# EAGLE design arduino_minimal (EAGLE 7.2.0)
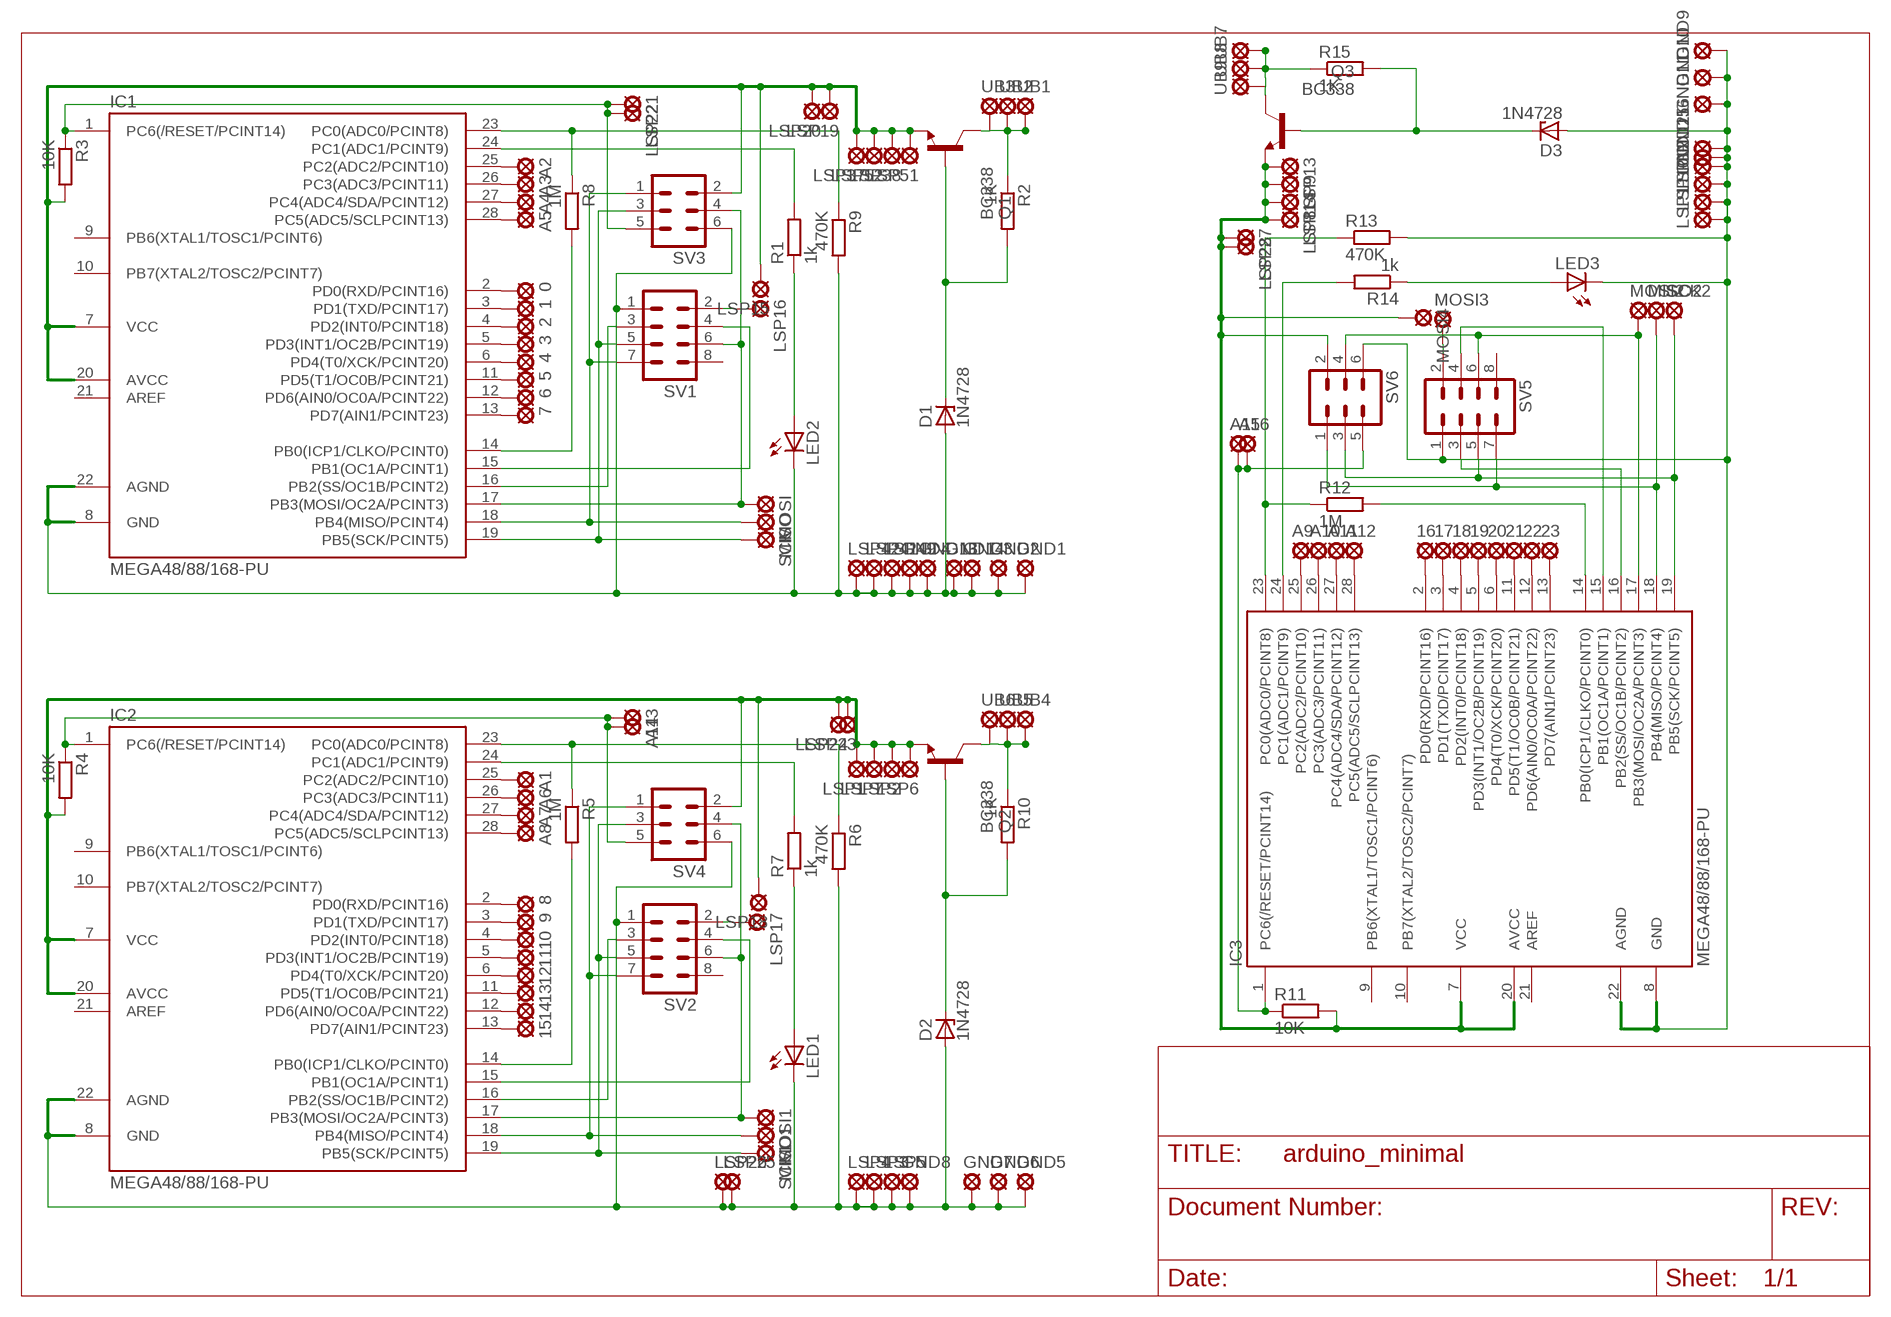
[diagram p0: schematic, sheet 1]

## Parts
0  LSP10  [LSP10]
1  LSP10  [LSP10]
2  LSP10  [LSP10]
3  LSP10  [LSP10]
4  LSP10  [LSP10]
5  LSP10  [LSP10]
6  LSP10  [LSP10]
7  LSP10  [LSP10]
8  LSP10  [LSP10]
9  LSP10  [LSP10]
10  LSP10  [LSP10]
11  LSP10  [LSP10]
12  LSP10  [LSP10]
13  LSP10  [LSP10]
14  LSP10  [LSP10]
15  LSP10  [LSP10]
16  LSP10  [LSP10]
17  LSP10  [LSP10]
18  LSP10  [LSP10]
19  LSP10  [LSP10]
20  LSP10  [LSP10]
21  LSP10  [LSP10]
22  LSP10  [LSP10]
23  LSP10  [LSP10]
A1  LSP10  [LSP10]
A2  LSP10  [LSP10]
A3  LSP10  [LSP10]
A4  LSP10  [LSP10]
A5  LSP10  [LSP10]
A6  LSP10  [LSP10]
A7  LSP10  [LSP10]
A8  LSP10  [LSP10]
A9  LSP10  [LSP10]
A10  LSP10  [LSP10]
A11  LSP10  [LSP10]
A12  LSP10  [LSP10]
A13  LSP10  [LSP10]
A14  LSP10  [LSP10]
A15  LSP10  [LSP10]
A16  LSP10  [LSP10]
D1  1N4728  [DO41Z10]
D2  1N4728  [DO41Z10]
D3  1N4728  [DO41Z10]
GND1  LSP10  [LSP10]
GND2  LSP10  [LSP10]
GND3  LSP10  [LSP10]
GND4  LSP10  [LSP10]
GND5  LSP10  [LSP10]
GND6  LSP10  [LSP10]
GND7  LSP10  [LSP10]
GND8  LSP10  [LSP10]
GND9  LSP10  [LSP10]
GND10  LSP10  [LSP10]
GND11  LSP10  [LSP10]
GND12  LSP10  [LSP10]
GND13  LSP10  [LSP10]
GND14  LSP10  [LSP10]
GND15  LSP10  [LSP10]
GND16  LSP10  [LSP10]
IC1  MEGA48/88/168-PU  [DIL28-3]
IC2  MEGA48/88/168-PU  [DIL28-3]
IC3  MEGA48/88/168-PU  [DIL28-3]
LED1  LED3MM  [LED3MM]
LED2  LED3MM  [LED3MM]
LED3  LED3MM  [LED3MM]
LSP1  LSP10  [LSP10]
LSP2  LSP10  [LSP10]
LSP3  LSP10  [LSP10]
LSP4  LSP10  [LSP10]
LSP5  LSP10  [LSP10]
LSP6  LSP10  [LSP10]
LSP7  LSP10  [LSP10]
LSP8  LSP10  [LSP10]
LSP9  LSP10  [LSP10]
LSP10  LSP10  [LSP10]
LSP11  LSP10  [LSP10]
LSP12  LSP10  [LSP10]
LSP13  LSP10  [LSP10]
LSP14  LSP10  [LSP10]
LSP15  LSP10  [LSP10]
LSP16  LSP10  [LSP10]
LSP17  LSP10  [LSP10]
LSP18  LSP10  [LSP10]
LSP19  LSP10  [LSP10]
LSP20  LSP10  [LSP10]
LSP21  LSP10  [LSP10]
LSP22  LSP10  [LSP10]
LSP23  LSP10  [LSP10]
LSP24  LSP10  [LSP10]
LSP25  LSP10  [LSP10]
LSP26  LSP10  [LSP10]
LSP27  LSP10  [LSP10]
LSP28  LSP10  [LSP10]
LSP37  LSP10  [LSP10]
LSP38  LSP10  [LSP10]
LSP41  LSP10  [LSP10]
LSP42  LSP10  [LSP10]
LSP49  LSP10  [LSP10]
LSP51  LSP10  [LSP10]
LSP52  LSP10  [LSP10]
MISO  LSP10  [LSP10]
MISO1  LSP10  [LSP10]
MISO2  LSP10  [LSP10]
MOSI  LSP10  [LSP10]
MOSI1  LSP10  [LSP10]
MOSI2  LSP10  [LSP10]
MOSI3  LSP10  [LSP10]
MOSI4  LSP10  [LSP10]
Q1  BC338  [TO92-EBC]
Q2  BC338  [TO92-EBC]
Q3  BC338  [TO92-EBC]
R1  1k  R-EU_0204/7  [0204/7]
R2  1K  R-EU_0204/7  [0204/7]
R3  10K  R-EU_0204/7  [0204/7]
R4  10K  R-EU_0204/7  [0204/7]
R5  1M  R-EU_0204/7  [0204/7]
R6  470K  R-EU_0204/7  [0204/7]
R7  1k  R-EU_0204/7  [0204/7]
R8  1M  R-EU_0204/7  [0204/7]
R9  470K  R-EU_0204/7  [0204/7]
R10  1K  R-EU_0204/7  [0204/7]
R11  10K  R-EU_0204/7  [0204/7]
R12  1M  R-EU_0204/7  [0204/7]
R13  470K  R-EU_0204/7  [0204/7]
R14  1k  R-EU_0204/7  [0204/7]
R15  1K  R-EU_0204/7  [0204/7]
SCK  LSP10  [LSP10]
SCK1  LSP10  [LSP10]
SCK2  LSP10  [LSP10]
SV1  MA04-2  [MA04-2]
SV2  MA04-2  [MA04-2]
SV3  MA03-2  [MA03-2]
SV4  MA03-2  [MA03-2]
SV5  MA04-2  [MA04-2]
SV6  MA03-2  [MA03-2]
UB1  LSP10  [LSP10]
UB2  LSP10  [LSP10]
UB3  LSP10  [LSP10]
UB4  LSP10  [LSP10]
UB5  LSP10  [LSP10]
UB6  LSP10  [LSP10]
UB7  LSP10  [LSP10]
UB8  LSP10  [LSP10]
UB9  LSP10  [LSP10]

## Nets
CE1: IC1.16(PB2(SS/OC1B/PCINT2)) SV1.3
CSN1: IC1.15(PB1(OC1A/PCINT1)) SV1.4
GND: D1.A GND1.MP GND2.MP GND3.MP GND4.MP GND13.MP GND14.MP IC1.8(GND) IC1.22(AGND) LED2.K(C) LSP41.MP LSP42.MP LSP49.MP R9.2 SV1.1 SV3.6
MISO1: IC1.18(PB4(MISO/PCINT4)) MISO.MP SV1.7 SV3.1
MOSI1: IC1.17(PB3(MOSI/OC2A/PCINT3)) MOSI.MP SV1.6 SV3.4
N$1: A13.MP A14.MP IC2.1(PC6(/RESET/PCINT14)) R4.1 SV4.5
N$2: LSP16.MP SV1.2
N$3: IC1.14(PB0(ICP1/CLKO/PCINT0)) R8.2
N$4: IC2.14(PB0(ICP1/CLKO/PCINT0)) R5.2
N$5: IC1.23(PC0(ADC0/PCINT8)) R8.1 R9.1
N$6: IC2.23(PC0(ADC0/PCINT8)) R5.1 R6.1
N$7: IC2.24(PC1(ADC1/PCINT9)) R7.2
N$8: LED1.A R7.1
N$9: IC1.24(PC1(ADC1/PCINT9)) R1.2
N$10: LED2.A R1.1
N$11: IC2.15(PB1(OC1A/PCINT1)) SV2.4
N$12: IC2.16(PB2(SS/OC1B/PCINT2)) SV2.3
N$13: IC2.17(PB3(MOSI/OC2A/PCINT3)) MOSI1.MP SV2.6 SV4.4
N$14: IC2.18(PB4(MISO/PCINT4)) MISO1.MP SV2.7 SV4.1
N$15: IC2.19(PB5(SCK/PCINT5)) SCK1.MP SV2.5 SV4.3
N$18: LSP17.MP SV2.2
N$19: MOSI3.MP SV5.2
N$21: 15.MP IC2.13(PD7(AIN1/PCINT23))
N$22: 14.MP IC2.12(PD6(AIN0/OC0A/PCINT22))
N$23: 13.MP IC2.11(PD5(T1/OC0B/PCINT21))
N$24: 12.MP IC2.6(PD4(T0/XCK/PCINT20))
N$25: 11.MP IC2.5(PD3(INT1/OC2B/PCINT19))
N$26: 10.MP IC2.4(PD2(INT0/PCINT18))
N$27: 9.MP IC2.3(PD1(TXD/PCINT17))
N$28: 8.MP IC2.2(PD0(RXD/PCINT16))
N$29: A1.MP IC2.25(PC2(ADC2/PCINT10))
N$30: A6.MP IC2.26(PC3(ADC3/PCINT11))
N$31: A7.MP IC2.27(PC4(ADC4/SDA/PCINT12))
N$32: A8.MP IC2.28(PC5(ADC5/SCLPCINT13))
N$33: 7.MP IC1.13(PD7(AIN1/PCINT23))
N$34: 6.MP IC1.12(PD6(AIN0/OC0A/PCINT22))
N$35: 5.MP IC1.11(PD5(T1/OC0B/PCINT21))
N$36: 4.MP IC1.6(PD4(T0/XCK/PCINT20))
N$37: 3.MP IC1.5(PD3(INT1/OC2B/PCINT19))
N$38: 2.MP IC1.4(PD2(INT0/PCINT18))
N$39: 1.MP IC1.3(PD1(TXD/PCINT17))
N$40: 0.MP IC1.2(PD0(RXD/PCINT16))
N$41: A2.MP IC1.25(PC2(ADC2/PCINT10))
N$42: A3.MP IC1.26(PC3(ADC3/PCINT11))
N$43: A4.MP IC1.27(PC4(ADC4/SDA/PCINT12))
N$44: A5.MP IC1.28(PC5(ADC5/SCLPCINT13))
N$46: D2.A GND5.MP GND6.MP GND7.MP GND8.MP IC2.8(GND) IC2.22(AGND) LED1.K(C) LSP3.MP LSP4.MP LSP5.MP LSP25.MP LSP26.MP R6.2 SV2.1 SV4.6
N$47: Q1.C R2.1 UB1.MP UB2.MP UB3.MP
N$48: D1.C Q1.B R2.2
N$49: Q2.C R10.1 UB4.MP UB5.MP UB6.MP
N$50: D2.C Q2.B R10.2
N$51: A15.MP A16.MP IC3.1(PC6(/RESET/PCINT14)) R11.1 SV6.5
N$52: IC3.14(PB0(ICP1/CLKO/PCINT0)) R12.2
N$53: IC3.23(PC0(ADC0/PCINT8)) R12.1 R13.1
N$54: IC3.24(PC1(ADC1/PCINT9)) R14.2
N$55: LED3.A R14.1
N$56: IC3.15(PB1(OC1A/PCINT1)) SV5.4
N$57: IC3.16(PB2(SS/OC1B/PCINT2)) SV5.3
N$58: IC3.17(PB3(MOSI/OC2A/PCINT3)) MOSI2.MP SV5.6 SV6.4
N$59: IC3.18(PB4(MISO/PCINT4)) MISO2.MP SV5.7 SV6.1
N$60: IC3.19(PB5(SCK/PCINT5)) SCK2.MP SV5.5 SV6.3
N$61: 23.MP IC3.13(PD7(AIN1/PCINT23))
N$62: 22.MP IC3.12(PD6(AIN0/OC0A/PCINT22))
N$63: 21.MP IC3.11(PD5(T1/OC0B/PCINT21))
N$64: 20.MP IC3.6(PD4(T0/XCK/PCINT20))
N$65: 19.MP IC3.5(PD3(INT1/OC2B/PCINT19))
N$66: 18.MP IC3.4(PD2(INT0/PCINT18))
N$67: 17.MP IC3.3(PD1(TXD/PCINT17))
N$68: 16.MP IC3.2(PD0(RXD/PCINT16))
N$69: A9.MP IC3.25(PC2(ADC2/PCINT10))
N$70: A10.MP IC3.26(PC3(ADC3/PCINT11))
N$71: A11.MP IC3.27(PC4(ADC4/SDA/PCINT12))
N$72: A12.MP IC3.28(PC5(ADC5/SCLPCINT13))
N$73: D3.A GND9.MP GND10.MP GND11.MP GND12.MP GND15.MP GND16.MP IC3.8(GND) IC3.22(AGND) LED3.K(C) LSP10.MP LSP11.MP LSP12.MP R13.2 SV5.1 SV6.6
N$74: Q3.C R15.1 UB7.MP UB8.MP UB9.MP
N$75: D3.C Q3.B R15.2
RES: IC1.1(PC6(/RESET/PCINT14)) LSP21.MP LSP22.MP R3.1 SV3.5
SCK1: IC1.19(PB5(SCK/PCINT5)) SCK.MP SV1.5 SV3.3
VCC: IC1.7(VCC) IC1.20(AVCC) LSP15.MP LSP19.MP LSP20.MP LSP37.MP LSP38.MP LSP51.MP LSP52.MP Q1.E R3.2 SV3.2
VCC1: IC2.7(VCC) IC2.20(AVCC) LSP1.MP LSP2.MP LSP6.MP LSP7.MP LSP18.MP LSP23.MP LSP24.MP Q2.E R4.2 SV4.2
VCC2: IC3.7(VCC) IC3.20(AVCC) LSP8.MP LSP9.MP LSP13.MP LSP14.MP LSP27.MP LSP28.MP MOSI4.MP Q3.E R11.2 SV6.2
Unconnected: IC1.9(PB6(XTAL1/TOSC1/PCINT6)) IC1.10(PB7(XTAL2/TOSC2/PCINT7)) IC1.21(AREF) IC2.9(PB6(XTAL1/TOSC1/PCINT6)) IC2.10(PB7(XTAL2/TOSC2/PCINT7)) IC2.21(AREF) IC3.9(PB6(XTAL1/TOSC1/PCINT6)) IC3.10(PB7(XTAL2/TOSC2/PCINT7)) IC3.21(AREF) SV1.8 SV2.8 SV5.8

## Library data of the parts
0 1-23 A1-A16 GND1-GND16 LSP1-LSP28 LSP37 LSP38 LSP41 LSP42 LSP49 LSP51 LSP52 MISO MISO1 MISO2 MOSI MOSI1-MOSI4 SCK SCK1 SCK2 UB1-UB9 = solpad:LSP10: SOLDER PAD drill 1.0 mm, distributor Buerklin, 12H555
D1-D3 = diode:1N4728: Z DIODE 3.3 V, 1W, 5 percent
IC1-IC3 = avr-7:MEGA48/88/168-PU
LED1-LED3 = led:LED: LED OSRAM: - CHIPLED LG R971, LG N971, LY N971, LG Q971, LY Q971, LO R971, LY R971 LH N974, LH R974 LS Q976, LO Q976, LY Q976 LO Q996 - Hyper CHIPLED LW Q18S LB Q993, LB Q99A, LB R99A - SideLED LS A670, LO A670, LY A670, LG A670, LP A670 LB A673, LV A673, LT A673, LW A673 LH A674 LY A675 LS A676, LA A676, LO A676, LY A676, LW A676 LS A679, LY A679, LG A679 - Hyper Micro SIDELED® LS Y876, LA Y876, LO Y876, LY Y876 LT Y87S - SmartLED LW L88C, LW L88S LB L89C, LB L89S, LG L890 LS L89K, LO L89K, LY L89K LS L896, LA L896, LO L896, LY L896 - TOPLED LS T670, LO T670, LY T670, LG T670, LP T670 LSG T670, LSP T670, LSY T670, LOP T670, LYG T670 LG T671, LOG T671, LSG T671 LB T673, LV T673, LT T673, LW T673 LH T674 LS T676, LA T676, LO T676, LY T676, LB T676, LH T676, LSB T676, LW T676 LB T67C, LV T67C, LT T67C, LS T67K, LO T67K, LY T67K, LW E67C LS E67B, LA E67B, LO E67B, LY E67B, LB E67C, LV E67C, LT E67C LW T67C LS T679, LY T679, LG T679 LS T770, LO T770, LY T770, LG T770, LP T770 LB T773, LV T773, LT T773, LW T773 LH T774 LS E675, LA E675, LY E675, LS T675 LS T776, LA T776, LO T776, LY T776, LB T776 LHGB T686 LT T68C, LB T68C - Hyper Mini TOPLED® LB M676 - Mini TOPLED Santana® LG M470 LS M47K, LO M47K, LY M47K Source: http://www.osram.convergy.de LUXEON: - LUMILED® LXK2-PW12-R00, LXK2-PW12-S00, LXK2-PW14-U00, LXK2-PW14-V00 LXK2-PM12-R00, LXK2-PM12-S00, LXK2-PM14-U00 LXK2-PE12-Q00, LXK2-PE12-R00, LXK2-PE12-S00, LXK2-PE14-T00, LXK2-PE14-U00 LXK2-PB12-K00, LXK2-PB12-L00, LXK2-PB12-M00, LXK2-PB14-N00, LXK2-PB14-P00, LXK2-PB14-Q00 LXK2-PR12-L00, LXK2-PR12-M00, LXK2-PR14-Q00, LXK2-PR14-R00 LXK2-PD12-Q00, LXK2-PD12-R00, LXK2-PD12-S00 LXK2-PH12-R00, LXK2-PH12-S00 LXK2-PL12-P00, LXK2-PL12-Q00, LXK2-PL12-R00 Source: www.luxeon.com KINGBRIGHT: KA-3528ASYC Source: www.kingbright.com
Q1-Q3 = transistor-npn:BC338*: NPN Transistor
R1-R15 = resistor:R-EU_: RESISTOR, European symbol
SV1 SV2 SV5 = con-lstb:MA04-2: PIN HEADER; OC_FARNELL: unknown; OC_NEWARK: unknown
SV3 SV4 SV6 = con-lstb:MA03-2: PIN HEADER; OC_FARNELL: unknown; OC_NEWARK: unknown

## Board
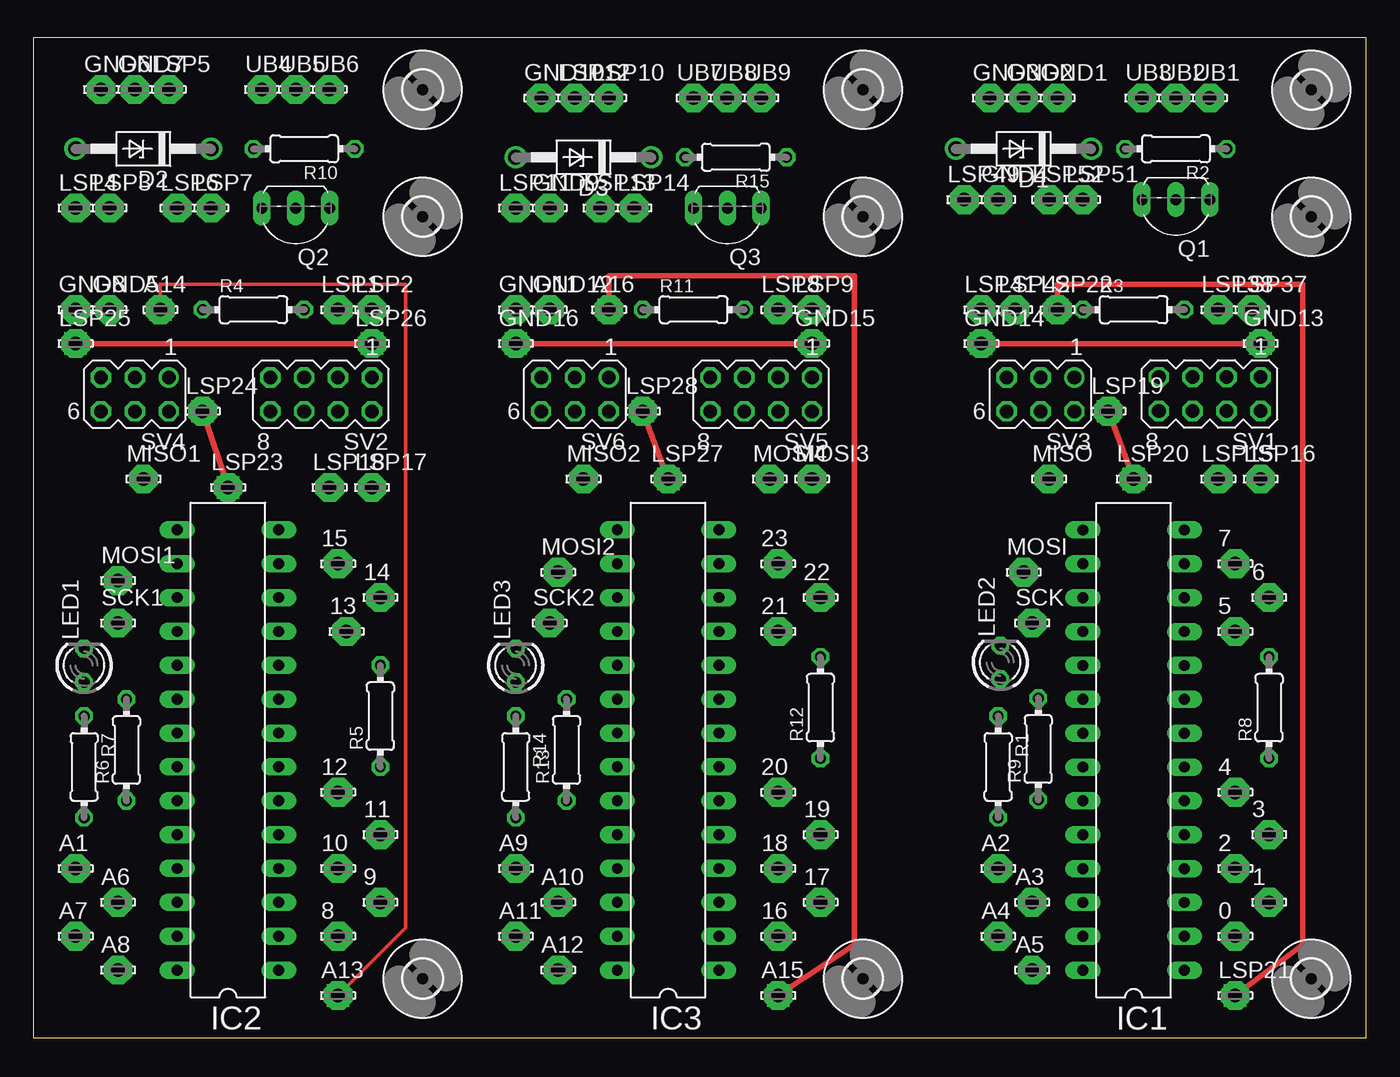
[diagram p1: board, top side]
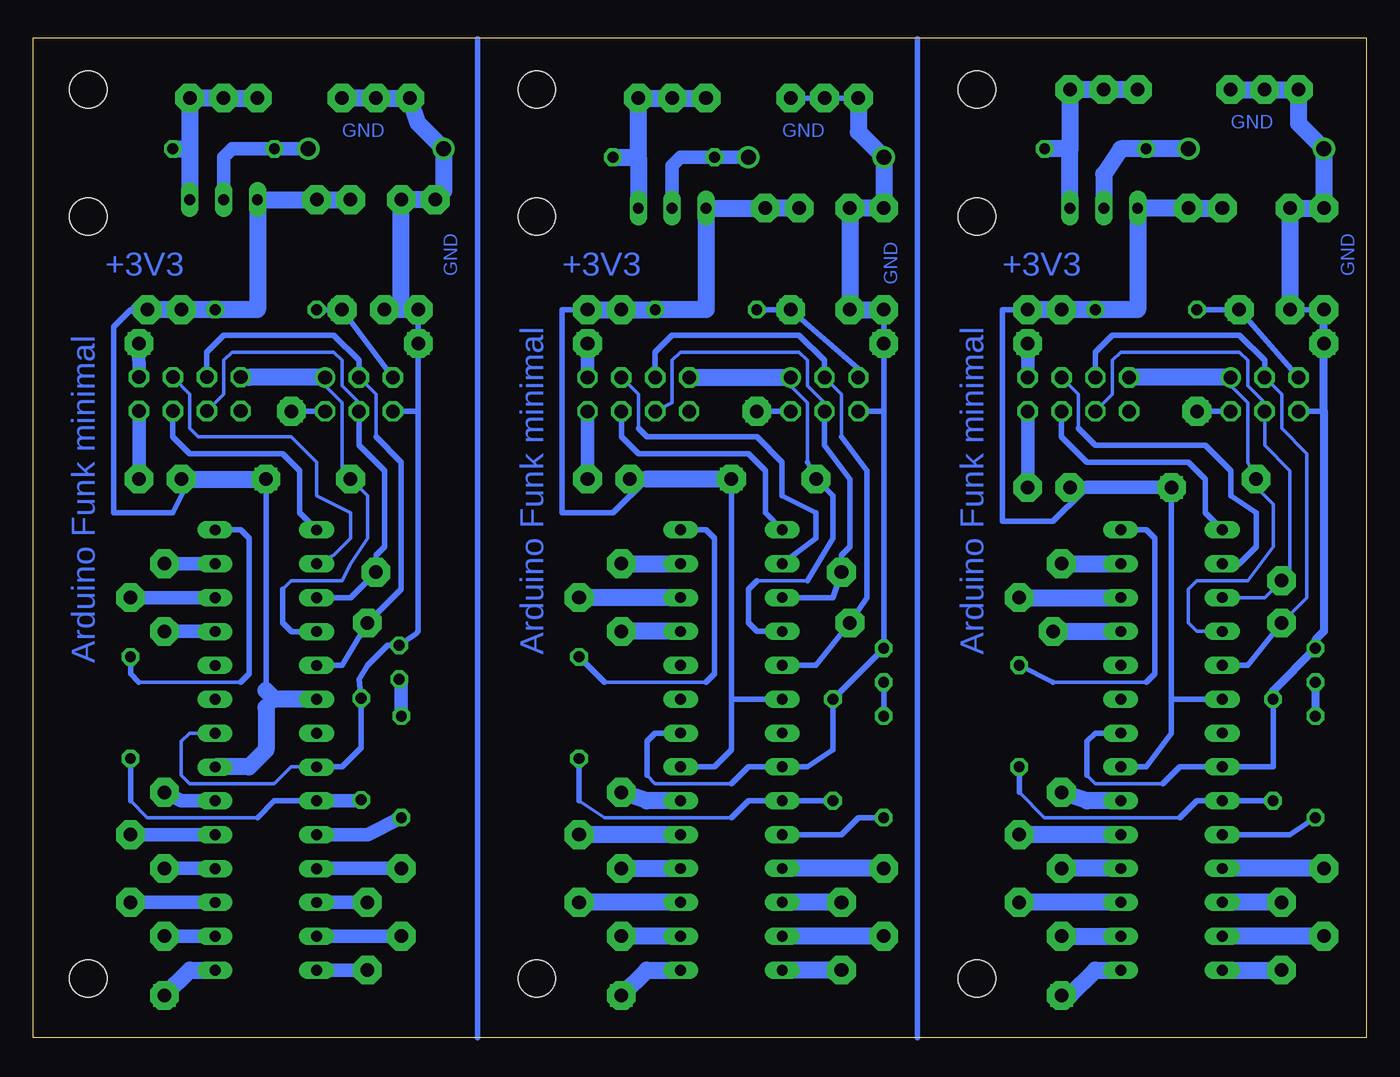
[diagram p2: board, bottom side, seen from below]

Size 100 x 75 mm. Coordinates in mm from the lower left corner, seen from the top.
Outline: 0,0 100,0 100,75 0,75 0,0
Copper layers (1*16): Top 0.035mm / dielectric 1.5mm / Bottom 0.035mm
Design rules "default": minimum track width 10mil, minimum drill 24mil, track to track 8mil, track to pad 8mil, pad to pad 8mil, via to via 8mil, smd to smd 8mil, copper to edge 40mil, drill to drill 8mil, minimum pad ring 10mil, minimum via ring 8mil, stop-mask expansion 4mil, vias tented up to drill 0mil, thermal gap 10mil

### Footprints (pad centres in the part's own frame; a part is rotated, then mirrored left to right if it is on the bottom)
LSP10 = drill 1.016 pad 2.159 octagon: MP 0,0
DO41Z10 = drill 1.118: A 5.08,0; C -5.08,0
DIL28-3 = drill 0.813 long: 1 -16.51,-3.81; 2 -13.97,-3.81; 3 -11.43,-3.81; 4 -8.89,-3.81; 5 -6.35,-3.81; 6 -3.81,-3.81; 7 -1.27,-3.81; 8 1.27,-3.81; 9 3.81,-3.81; 10 6.35,-3.81; 11 8.89,-3.81; 12 11.43,-3.81; 13 13.97,-3.81; 14 16.51,-3.81; 15 16.51,3.81; 16 13.97,3.81; 17 11.43,3.81; 18 8.89,3.81; 19 6.35,3.81; 20 3.81,3.81; 21 1.27,3.81; 22 -1.27,3.81; 23 -3.81,3.81; 24 -6.35,3.81; 25 -8.89,3.81; 26 -11.43,3.81; 27 -13.97,3.81; 28 -16.51,3.81
LED3MM = drill 0.813 octagon: A -1.27,0; K 1.27,0
TO92-EBC = drill 0.813 long: B 0,-1.27; C -2.54,-1.27; E 2.54,-1.27
0204/7 = drill 0.813 octagon: 1 -3.81,0; 2 3.81,0
MA04-2 = drill 1.016 octagon: 1 -3.81,-1.27; 2 -3.81,1.27; 3 -1.27,-1.27; 4 -1.27,1.27; 5 1.27,-1.27; 6 1.27,1.27; 7 3.81,-1.27; 8 3.81,1.27
MA03-2 = drill 1.016: 1 -2.54,-1.27 | drill 1.016 octagon: 2 -2.54,1.27; 3 0,-1.27; 4 0,1.27; 5 2.54,-1.27; 6 2.54,1.27
2,8 = hole 2.8: 0,0

### Placement (x,y rotation side)
0  90.17,7.62 0 top
1  92.71,10.16 0 top
2  90.17,12.7 0 top
3  92.71,15.24 0 top
4  90.17,18.41 0 top
5  90.17,30.48 0 top
6  92.71,33.02 0 top
7  90.17,35.56 0 top
8  22.86,7.62 0 top
9  26.04,10.16 0 top
10  22.86,12.7 0 top
11  26.04,15.24 0 top
12  22.86,18.41 0 top
13  23.5,30.48 0 top
14  26.04,33.02 0 top
15  22.86,35.56 0 top
16  55.88,7.62 0 top
17  59.05,10.16 0 top
18  55.88,12.7 0 top
19  59.05,15.24 0 top
20  55.88,18.41 0 top
21  55.88,30.48 0 top
22  59.05,33.02 0 top
23  55.88,35.56 0 top
A1  3.17,12.7 0 top
A2  72.39,12.7 0 top
A3  74.93,10.16 0 top
A4  72.39,7.62 0 top
A5  74.93,5.08 0 top
A6  6.35,10.16 0 top
A7  3.17,7.62 0 top
A8  6.35,5.08 0 top
A9  36.2,12.7 0 top
A10  39.37,10.16 0 top
A11  36.2,7.62 0 top
A12  39.37,5.08 0 top
A13  22.86,3.17 0 top
A14  9.53,54.61 0 top
A15  55.88,3.17 0 top
A16  43.18,54.61 0 top
D1  74.3,66.67 180 top
D2  8.26,66.67 180 top
D3  41.27,66.04 180 top
GND1  76.83,70.48 0 top
GND2  74.3,70.48 0 top
GND3  71.75,70.48 0 top
GND4  72.39,62.87 0 top
GND5  5.71,54.61 0 top
GND6  5.08,71.12 0 top
GND7  7.62,71.12 0 top
GND8  3.17,54.61 0 top
GND9  38.73,62.23 0 top
GND10  38.1,70.48 0 top
GND11  36.2,54.61 0 top
GND12  38.73,54.61 0 top
GND13  92.08,52.07 0 top
GND14  71.12,52.07 0 top
GND15  58.42,52.07 0 top
GND16  36.2,52.07 0 top
IC1  82.56,21.58 90 top
IC2  14.61,21.59 90 top
IC3  47.62,21.59 90 top
LED1  3.81,27.94 90 top
LED2  72.55,28.16 90 top
LED3  36.2,27.94 90 top
LSP1  22.86,54.61 0 top
LSP2  25.4,54.61 0 top
LSP3  5.71,62.23 0 top
LSP4  3.17,62.23 0 top
LSP5  10.16,71.12 0 top
LSP6  10.79,62.23 0 top
LSP7  13.34,62.23 0 top
LSP8  55.88,54.61 0 top
LSP9  58.42,54.61 0 top
LSP10  43.18,70.48 0 top
LSP11  36.2,62.23 0 top
LSP12  40.64,70.48 0 top
LSP13  42.55,62.23 0 top
LSP14  45.09,62.23 0 top
LSP15  88.9,41.91 0 top
LSP16  92.08,41.91 0 top
LSP17  25.4,41.27 0 top
LSP18  22.23,41.27 0 top
LSP19  80.64,46.99 0 top
LSP20  82.55,41.91 0 top
LSP21  90.17,3.17 0 top
LSP22  76.83,54.61 0 top
LSP23  14.61,41.27 0 top
LSP24  12.7,46.99 0 top
LSP25  3.17,52.07 0 top
LSP26  25.4,52.07 0 top
LSP27  47.62,41.91 0 top
LSP28  45.72,46.99 0 top
LSP37  91.44,54.61 0 top
LSP38  88.9,54.61 0 top
LSP41  71.12,54.61 0 top
LSP42  73.66,54.61 0 top
LSP49  69.85,62.87 0 top
LSP51  78.74,62.87 0 top
LSP52  76.2,62.87 0 top
MISO  76.2,41.91 0 top
MISO1  8.26,41.91 0 top
MISO2  41.27,41.91 0 top
MOSI  74.3,34.92 0 top
MOSI1  6.35,34.29 0 top
MOSI2  39.37,34.92 0 top
MOSI3  58.42,41.91 0 top
MOSI4  55.24,41.91 0 top
Q1  85.72,61.59 180 top
Q2  19.68,60.96 180 top
Q3  52.07,60.96 180 top
R1  72.39,20.32 270 top
R2  85.72,66.67 180 top
R3  82.55,54.61 0 top
R4  16.51,54.61 0 top
R5  26.04,24.13 90 top
R6  6.99,21.59 90 top
R7  3.81,20.32 270 top
R8  92.71,24.77 90 top
R9  75.4,21.66 90 top
R10  20.32,66.67 180 top
R11  49.53,54.61 0 top
R12  59.05,24.77 90 top
R13  40.01,21.59 90 top
R14  36.2,20.32 270 top
R15  52.7,66.04 180 top
SCK  74.93,31.11 0 top
SCK1  6.35,31.11 0 top
SCK2  38.73,31.11 0 top
SV1  88.25,48.28 180 top
SV2  21.59,48.26 180 top
SV3  75.56,48.26 180 top
SV4  7.62,48.26 180 top
SV5  54.61,48.26 180 top
SV6  40.64,48.26 180 top
U$1  [2,8]  29.21,4.45 0 top
U$2  [2,8]  62.23,4.45 0 top
U$3  [2,8]  95.89,4.45 0 top
U$4  [2,8]  29.21,71.12 0 top
U$5  [2,8]  29.21,61.59 0 top
U$6  [2,8]  62.23,61.59 0 top
U$7  [2,8]  62.23,71.12 0 top
U$8  [2,8]  95.89,71.12 0 top
U$9  [2,8]  95.89,61.59 0 top
UB1  88.27,70.48 0 top
UB2  85.72,70.48 0 top
UB3  83.19,70.48 0 top
UB4  17.14,71.12 0 top
UB5  19.68,71.12 0 top
UB6  22.23,71.12 0 top
UB7  49.53,70.48 0 top
UB8  52.07,70.48 0 top
UB9  54.61,70.48 0 top

### Tracks (layer width: path | path; a pad name or v marks a point on that pad's centre or on a via)
CE1
  Bottom 0.254: IC1.16 77.47,36.2 76.2,37.47 76.2,39.37 78.74,40.64 78.74,43.18 80.64,45.09 87.63,45.09 88.27,45.72 88.27,48.26 SV1.3
CSN1
  Bottom 0.406: IC1.15 80.01,39.37 80.01,40 80.02,40.63 80.01,42.55 81.28,43.81 88.27,43.81 89.53,45.09 89.53,47 SV1.4
GND  (via drill 0.6 pad 1.68)
  Top 0.406: GND14.MP GND13.MP
  Bottom 0.254: IC1.22 80.01,20.32 80.64,20.32 81.92,19.05 88.27,19.05 88.9,19.68 88.9,22.23 88.27,22.86 IC1.8
  Bottom 0.406: 91.77,49.53 SV1.1 | 69.22,63.5 LSP49.MP | LSP41.MP GND14.MP 71.12,46.99 | GND13.MP 92.08,51.92 | 71.12,46.99 71.12,30.48 71.28,30.32 LED2.K 73.44,29.43 74.93,27.94 75.56,26.91 R9.2 75.4,21.75 76.83,20.32 78.74,20.32 IC1.22 | 71.12,46.99 SV3.6
  Bottom 1.016: 92.08,51.92 SV1.1
  Bottom 1.27: GND1.MP GND2.MP GND3.MP 71.12,68.58 D1.A 69.22,63.5 | 72.39,54.61 GND4.MP LSP49.MP | LSP41.MP 72.39,54.61 | 72.39,54.61 LSP42.MP
  other vias: 71.12,52.07 92.08,52.07
MISO1
  Bottom 0.254: 83.82,49.53 SV1.7 | 81.28,33.66 80.64,34.29 76.83,34.29 76.2,35.56 74.93,37.47 74.93,40.64 MISO.MP | 76.83,42.55 76.83,47.62 78.11,48.9 SV3.1
  Bottom 0.406: IC1.18 80.64,30.47 81.28,31.11 81.28,33.66 | MISO.MP 76.83,42.55
  Bottom 1.27: SV3.1 83.82,49.53
MOSI1
  Bottom 0.254: SV3.4 75.56,47.62 76.83,48.9 76.83,50.8 77.47,51.44 85.09,51.44 85.72,50.8 85.72,48.26 86.36,47.62 SV1.6
  Bottom 0.406: IC1.17 78.74,33.02 76.2,33.02 MOSI.MP 74.3,36.2 73.66,36.83 73.66,42.55 75.56,44.45 SV3.4
N$1  (via drill 0.6 pad 1.68)
  Top 0.254: A13.MP 27.94,8.26 27.94,56.52 9.53,56.52 A14.MP
  Bottom 0.406: R4.1 A14.MP SV4.5
  Bottom 1.27: A13.MP 22.23,3.17 20.32,5.08 IC2.1
  other vias: 9.53,54.61 22.86,3.17
N$2
  Bottom 0.406: 92.06,41.92 LSP16.MP
  Bottom 1.016: SV1.2 92.06,41.92
N$3
  Bottom 0.254: 84.45,26.67 92.08,26.67
  Bottom 0.406: IC1.14 84.44,38.09 83.82,37.47 83.82,27.3 84.45,26.67 | 92.08,26.67 92.71,27.3 R8.2
N$4
  Bottom 0.254: 23.5,26.67 16.51,26.67
  Bottom 0.406: R5.2 23.5,26.67 | 16.51,26.67 15.88,27.3 15.88,37.47 16.51,38.1 IC2.14
N$5
  Bottom 0.254: IC1.23 | 75.56,17.78 R9.1 | 83.19,16.51 91.44,16.51 92.71,17.78
  Bottom 0.406: IC1.23 81.92,17.77 83.19,16.51 | 92.71,17.78 R8.1
  Bottom 1.016: 75.56,17.78 IC1.23
N$6
  Bottom 0.254: 26.04,18.41 24.13,16.51 13.97,16.51
  Bottom 0.406: R6.1 IC2.23 12.7,17.78 13.97,16.51 | R5.1 26.04,18.41
N$7
  Bottom 0.406: R7.2 5.71,15.24 IC2.24
N$8
  Bottom 0.61: LED1.A R7.1
N$9
  Bottom 0.254: IC1.24
  Bottom 1.016: R1.2 74.93,15.24 IC1.24
N$10
  Bottom 0.254: 72.39,26.67 LED2.A
  Bottom 1.016: 72.39,26.67 R1.1
N$11
  Bottom 0.406: SV2.4 22.86,45.09 20.95,43.18 13.34,43.18 12.06,41.91 12.06,39.37 IC2.15
N$12
  Bottom 0.254: SV2.3 21.59,48.26 21.59,45.72
  Bottom 0.406: 21.59,45.72 20.32,44.45 12.06,44.45 10.16,42.55 10.16,40.64 8.26,39.37 8.26,36.83 9.53,35.56 IC2.16
N$13
  Bottom 0.254: SV2.6 19.05,48.26 19.05,50.8 18.41,51.44 9.53,51.44 8.89,50.8 8.89,48.9 7.62,47.62 SV4.4 7.62,44.45 5.71,42.55 5.71,34.92 MOSI1.MP 7.62,33.02 IC2.17
N$14
  Bottom 0.254: IC2.18 12.7,30.48 13.34,31.11 13.34,33.66 12.7,34.29 8.89,34.29 6.99,36.83 6.99,40.01 8.26,41.27 MISO1.MP 8.89,43.18 8.89,47.62 10.16,48.9
  Bottom 0.406: SV4.1 10.16,48.9
  Bottom 1.27: SV4.1 SV2.7
N$15
  Bottom 0.254: SCK1.MP 4.45,33.02 4.45,43.81 6.35,45.72 6.35,48.26 SV4.3
  Bottom 0.406: SV4.3 7.62,50.8 9.53,52.7 19.05,52.7 20.32,51.44 SV2.5 | IC2.19 8.89,27.94 SCK1.MP
N$18
  Bottom 1.016: LSP17.MP SV2.2
N$19
  Bottom 1.016: MOSI3.MP SV5.2
N$20
  Bottom 0.406: 33.66,74.93 33.66,0
N$21
  Bottom 1.27: 15.MP IC2.13
N$22
  Bottom 1.27: 14.MP IC2.12
N$23
  Bottom 1.27: 13.MP IC2.11
N$24
  Bottom 1.27: IC2.6 20.95,17.78 12.MP
N$25
  Bottom 1.27: IC2.5 11.MP
N$26
  Bottom 1.27: IC2.4 10.MP
N$27
  Bottom 1.27: IC2.3 9.MP
N$28
  Bottom 1.27: 8.MP IC2.2
N$29
  Bottom 1.27: A1.MP IC2.25
N$30
  Bottom 1.27: A6.MP IC2.26
N$31
  Bottom 1.27: A7.MP IC2.27
N$32
  Bottom 1.27: IC2.28 A8.MP
N$33
  Bottom 0.254: 87,35.56 IC1.13
  Bottom 1.016: 7.MP 87,35.56
N$34
  Bottom 0.254: 87,33.02 IC1.12
  Bottom 1.016: 6.MP 87,33.02
N$35
  Bottom 0.254: 87,30.48 IC1.11
  Bottom 1.016: 5.MP 87,30.48
N$36
  Bottom 0.254: 87,17.78 IC1.6
  Bottom 1.016: 4.MP 88.9,17.78 87,17.78
N$37
  Bottom 0.254: 87,15.24 IC1.5
  Bottom 1.016: 3.MP 87,15.24
N$38
  Bottom 0.254: 87,12.7 IC1.4
  Bottom 1.016: 2.MP 87,12.7
N$39
  Bottom 0.254: 87,10.16 IC1.3
  Bottom 1.016: 1.MP 87,10.16
N$40
  Bottom 0.254: 87,7.62 IC1.2
  Bottom 1.016: 0.MP 87,7.62
N$41
  Bottom 0.254: IC1.25
  Bottom 1.016: A2.MP IC1.25
N$42
  Bottom 0.254: IC1.26
  Bottom 1.016: A3.MP IC1.26
N$43
  Bottom 0.254: IC1.27
  Bottom 1.016: A4.MP IC1.27
N$44
  Bottom 0.254: IC1.28
  Bottom 1.016: A5.MP IC1.28
N$45
  Bottom 0.406: 66.67,74.93 66.67,0
N$46  (via drill 0.6 pad 1.68)
  Top 0.406: LSP26.MP LSP25.MP
  Bottom 0.254: 20.95,19.68 20.32,19.05 15.24,19.05 | R6.2 6.99,26.04 | 3.81,29.84 LED1.K
  Bottom 0.406: GND5.MP GND8.MP | 3.17,46.99 SV4.6 | IC2.8 20.32,22.86 20.95,22.23 20.95,19.68 | 15.24,19.05 13.97,20.32 IC2.22 6.99,20.32 R6.2
  Bottom 0.61: 6.99,26.04 LED1.K | 3.81,29.84 3.17,30.48 3.17,46.99 LSP25.MP GND8.MP
  Bottom 1.016: SV2.1 LSP26.MP
  Bottom 1.27: LSP5.MP GND7.MP GND6.MP 5.08,68.58 D2.A LSP4.MP 5.08,62.23 | LSP3.MP 5.08,62.23 | 5.08,62.23 5.71,61.59 GND5.MP
  other vias: 25.4,52.07 3.17,52.07
N$47
  Bottom 1.27: 88.27,66.67 Q1.C | R2.1 88.27,66.67 | UB3.MP UB2.MP UB1.MP 88.27,66.67
N$48
  Bottom 1.016: D1.C R2.2 85.09,66.67 85.72,66.04 Q1.B
N$49
  Bottom 1.27: UB4.MP UB5.MP UB6.MP 22.23,66.67 | Q2.C 22.23,66.67 | 22.23,66.67 R10.1
N$50
  Bottom 1.27: D2.C R10.2 18.41,66.67 19.68,64.77 Q2.B
N$51  (via drill 0.6 pad 1.68)
  Top 0.406: A16.MP 43.18,57.15 61.59,57.15 61.59,6.99 A15.MP
  Bottom 0.406: R11.1 A16.MP 38.1,50.16 SV6.5
  Bottom 1.27: A15.MP 53.98,5.08 IC3.1
  other vias: 55.88,3.17 43.18,54.61
N$52
  Bottom 0.254: 49.53,26.67 57.15,26.67
  Bottom 0.406: IC3.14 49.53,38.1 48.9,37.47 48.9,27.3 49.53,26.67 | 57.15,26.67 R12.2
N$53
  Bottom 0.254: 59.05,17.78 57.15,16.51 47.62,16.51
  Bottom 0.406: R12.1 59.05,17.78 | 47.62,16.51 46.35,17.78 IC3.23 R13.1
N$54
  Bottom 0.406: IC3.24 39.37,15.24 38.1,16.51 R14.2
N$55
  Bottom 0.406: LED3.A R14.1
N$56
  Bottom 0.406: SV5.4 55.88,45.09 54.61,43.81 46.35,43.81 45.09,42.55 45.09,39.37 IC3.15
N$57
  Bottom 0.254: SV5.3 54.61,48.26 54.61,45.72
  Bottom 0.406: 54.61,45.72 53.98,45.09 45.72,45.09 43.81,43.18 43.81,40.64 41.27,39.37 41.27,37.47 IC3.16
N$58
  Bottom 0.254: SV5.6 52.07,47.62 52.07,50.8 51.44,51.44 42.55,51.44 41.91,50.8 41.91,48.9 40.64,47.62 SV6.4
  Bottom 0.406: SV6.4 40.64,44.45 38.73,41.91 38.73,36.83 39.37,36.2 MOSI2.MP 40.01,33.02 IC3.17
N$59
  Bottom 0.254: 43.18,48.9 41.91,47.62 41.91,43.18 | 45.72,34.29 41.91,34.29
  Bottom 0.406: SV6.1 43.18,48.9 | 41.91,43.18 MISO2.MP 40.01,40.64 40.01,37.47 41.91,34.29 | IC3.18 45.72,30.48 46.35,31.11 46.35,33.66 45.72,34.29
  Bottom 1.27: SV5.7 SV6.1
N$60
  Bottom 0.254: SV6.3 39.37,48.26 39.37,45.09
  Bottom 0.406: SV5.5 53.34,51.44 52.07,52.7 42.55,52.7 40.64,50.8 SV6.3 | 39.37,45.09 37.47,42.55 37.47,33.02 SCK2.MP 41.27,27.94 IC3.19
N$61
  Bottom 1.27: 23.MP IC3.13
N$62
  Bottom 1.27: IC3.12 22.MP
N$63
  Bottom 1.27: IC3.11 21.MP
N$64
  Bottom 1.27: IC3.6 53.98,17.78 20.MP
N$65
  Bottom 1.27: IC3.5 19.MP
N$66
  Bottom 1.27: 18.MP IC3.4
N$67
  Bottom 1.27: IC3.3 17.MP
N$68
  Bottom 1.27: IC3.2 16.MP
N$69
  Bottom 1.27: A9.MP IC3.25
N$70
  Bottom 1.27: A10.MP IC3.26
N$71
  Bottom 1.27: A11.MP IC3.27
N$72
  Bottom 1.27: A12.MP IC3.28
N$73  (via drill 0.6 pad 1.68)
  Top 0.406: GND15.MP GND16.MP
  Bottom 0.254: 53.98,19.68 53.34,19.05 47.62,19.05
  Bottom 0.406: LSP10.MP LSP12.MP GND10.MP | IC3.8 53.34,22.86 53.98,22.23 53.98,19.68 | 47.62,19.05 46.35,20.32 IC3.22 41.91,20.32 40.01,21.59 R13.2 LED3.K 36.2,46.99 | GND11.MP GND16.MP 36.2,46.99 | SV6.6 36.2,46.99
  Bottom 1.016: SV5.1 GND15.MP
  Bottom 1.27: GND10.MP 38.1,67.94 D3.A LSP11.MP GND9.MP | 38.1,62.23 GND9.MP | GND9.MP GND12.MP GND11.MP
  other vias: 58.42,52.07 36.2,52.07
N$74
  Bottom 1.27: R15.1 54.61,66.04 | 54.61,66.04 UB9.MP UB8.MP UB7.MP | 54.61,66.04 Q3.C
N$75
  Bottom 1.016: D3.C R15.2 51.44,66.04 52.07,65.41 Q3.B
RES  (via drill 0.6 pad 1.68)
  Top 0.406: LSP22.MP 76.83,56.52 95.25,56.52 95.25,6.99 LSP21.MP
  Bottom 0.406: R3.1 LSP22.MP SV3.5 | IC1.1
  Bottom 1.27: LSP21.MP 88.27,5.08 IC1.1
  other vias: 90.17,3.17 76.83,54.61
SCK1
  Bottom 0.254: SV3.3 74.3,48.26 74.3,45.09
  Bottom 0.406: 74.3,45.09 72.39,43.18 72.39,33.66 SCK.MP 76.84,27.93 IC1.19 | SV1.5 87,51.44 85.72,52.7 77.47,52.7 75.56,50.8 SV3.3
VCC  (via drill 0.6 pad 1.68)
  Top 0.406: LSP19.MP LSP20.MP
  Bottom 0.406: LSP37.MP LSP38.MP | IC1.20 81.92,25.39 82.55,24.77 | 86.36,20.32 IC1.7 | 82.55,26.04 LSP20.MP | SV3.2 LSP19.MP | 92.08,54.61 92.71,54.61 93.98,53.34 93.98,39.37 89.53,39.37 88.27,41.91 88.27,41.27 LSP15.MP
  Bottom 1.27: LSP52.MP LSP51.MP Q1.E 83.19,54.61 R3.2 LSP38.MP 92.08,54.61 | 82.55,24.77 82.55,21.59 83.82,20.32 86.36,20.32 | IC1.20 81.91,25.39 82.55,26.04 | 88.27,41.91 LSP20.MP
  other vias: 80.64,46.99 82.55,41.91
VCC1  (via drill 0.6 pad 1.68)
  Top 0.406: LSP24.MP LSP23.MP
  Bottom 0.406: LSP2.MP 27.3,54.61 27.3,38.73 23.5,38.73 21.27,40.96 | IC2.7 16.51,20.32 14.61,22.86 14.61,25.4 | IC2.20 14.61,25.4 | 14.61,25.4 LSP23.MP | 20.95,41.27 21.27,40.96 | SV4.2 LSP24.MP | LSP18.MP 21.59,41.27 21.27,40.96
  Bottom 1.016: LSP23.MP 20.95,41.27
  Bottom 1.27: LSP6.MP LSP7.MP Q2.E 17.14,54.61 R4.2 LSP1.MP LSP2.MP
  other vias: 12.7,46.99 14.61,41.27
VCC2  (via drill 0.6 pad 1.68)
  Top 0.406: LSP28.MP LSP27.MP
  Bottom 0.406: IC3.7 48.9,20.32 47.62,21.59 47.62,25.4 | IC3.20 47.62,25.4 | 47.62,25.4 LSP27.MP | LSP9.MP 60.33,54.61 60.33,39.37 56.52,39.37 53.98,41.91 MOSI4.MP | SV6.2 LSP28.MP
  Bottom 1.27: LSP13.MP LSP14.MP Q3.E 49.53,54.61 R11.2 LSP8.MP LSP9.MP | LSP27.MP 53.98,41.91
  other vias: 45.72,46.99 47.62,41.91

### Text on the board
Bottom: GND | GND | GND | GND | GND | GND | +3V3 | +3V3 | +3V3 | Arduino Funk minimal | Arduino Funk minimal | Arduino Funk minimal
_tNames: GND6 | GND7 | LSP5 | UB4 | UB5 | UB6 | GND10 | LSP12 | LSP10 | UB7 | UB8 | UB9 | GND3 | GND2 | GND1 | UB3 | UB2 | UB1 | D2 | R10 | R15 | D1 | R2 | LSP4 | LSP3 | LSP6 | LSP7 | LSP11 | GND9 | LSP13 | D3 | LSP14 | LSP49 | GND4 | LSP52 | LSP51 | Q1 | Q2 | Q3 | GND8 | GND5 | R4 | LSP1 | LSP2 | GND11 | GND12 | R11 | LSP8 | LSP9 | LSP41 | LSP42 | R3 | LSP38 | LSP37 | SV4 | SV2 | SV6 | SV5 | SV3 | SV1 | MISO1 | MISO2 | MISO | 15 | 23 | 7 | MOSI1 | MOSI2 | MOSI | 14 | 22 | 6 | SCK1 | 13 | SCK2 | 21 | SCK | 5 | LED1 | LED3 | LED2 | R7 | R14 | R1 | R5 | R12 | R8 | 12 | 20 | 4 | R6 | R13 | R9 | 11 | 19 | 3 | A1 | 10 | A9 | 18 | A2 | 2 | A6 | 9 | A10 | 17 | A3 | 1 | A7 | 8 | A11 | 16 | A4 | 0 | A8 | A12 | A5 | IC2 | IC3 | IC1
_tValues: LSP10